# Altium schematic sheet ArtixBank14.SchDoc
size A
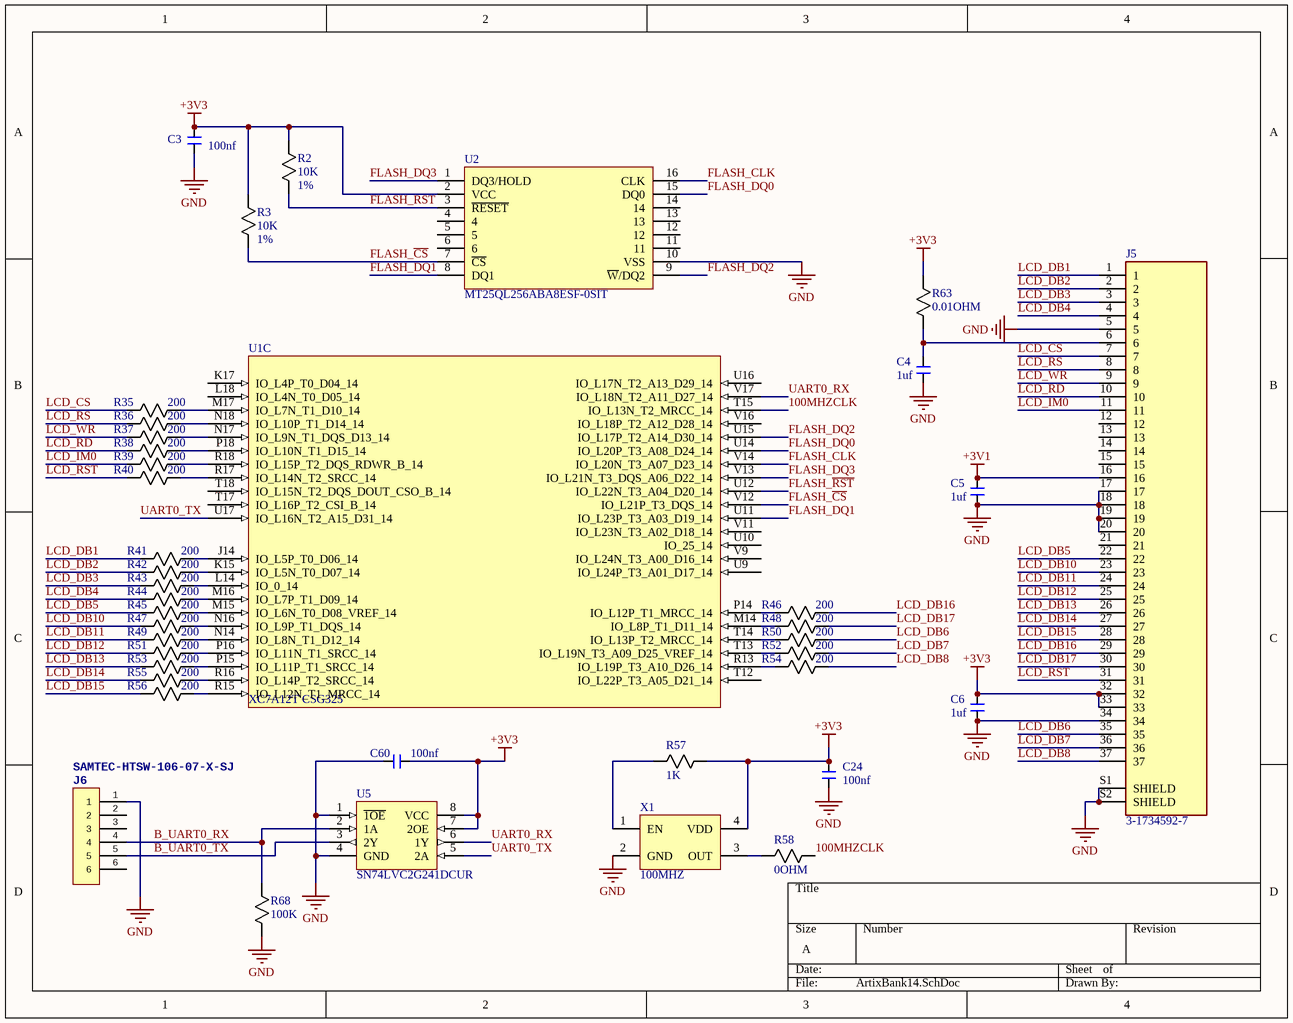
[diagram p0: ArtixBank14.SchDoc]

## Parts
C3  100nf  [0402Footprint]
C4  1uf  [0402Footprint]
C5  1uf  [0402Footprint]
C6  1uf  [0402Footprint]
C24  100nf  [0402Footprint]
C60  100nf  [0402Footprint]
J5  3-1734592-7  [TE_3-1734592-7]
J6  SAMTEC-HTSW-106-07-X-SJ  [SAMTEC-HTSW-106-07-X-S]
R2  10K  Tolerance: 1%  [RES_CRCW_0402]
R3  10K  Tolerance: 1%  [RES_CRCW_0402]
R35  200  [RES_CRCW_0402]
R36  200  [RES_CRCW_0402]
R37  200  [RES_CRCW_0402]
R38  200  [RES_CRCW_0402]
R39  200  [RES_CRCW_0402]
R40  200  [RES_CRCW_0402]
R41  200  [RES_CRCW_0402]
R42  200  [RES_CRCW_0402]
R43  200  [RES_CRCW_0402]
R44  200  [RES_CRCW_0402]
R45  200  [RES_CRCW_0402]
R46  200  [RES_CRCW_0402]
R47  200  [RES_CRCW_0402]
R48  200  [RES_CRCW_0402]
R49  200  [RES_CRCW_0402]
R50  200  [RES_CRCW_0402]
R51  200  [RES_CRCW_0402]
R52  200  [RES_CRCW_0402]
R53  200  [RES_CRCW_0402]
R54  200  [RES_CRCW_0402]
R55  200  [RES_CRCW_0402]
R56  200  [RES_CRCW_0402]
R57  1K  [RES_CRCW_0402]
R58  0OHM  [RES_CRCW_0402]
R63  0.01OHM  [RESC1508X06N]
R68  100K  [RES_CRCW_0402]
U1  XC7A12T CSG325  [BGA324C80P18X18_1500X1500X150]  (part C of 7)
U2  MT25QL256ABA8ESF-0SIT  [SOP127P1030X265-16N]
U5  SN74LVC2G241DCUR  [SOP50P310X90-8N]
X1  100MHZ  [SIT8008AI-12-33E-100.000000E]

## Nets
+3V1: C5.1 J5.16
+3V3: C3.1 C6.1 C24.1 C60.1 J5.32 J5.33 R2.1 R3.1 R57.1 R63.1 U2.2(VCC) U5.7(2OE) U5.8(VCC) X1.4(VDD)
GND: C3.2 C4.2 C5.2 C6.2 C24.2 C60.2 J5.5 J5.17 J5.18 J5.19 J5.20 J5.34 J5.S1(SHIELD) J5.S2(SHIELD) J6.1 R68.2 U2.10(VSS) U5.1(~{1OE}) U5.4(GND) X1.2(GND)
100MHZCLK: R58.1 U1.T15(IO_L13N_T2_MRCC_14)
B_UART0_RX: J6.4 R68.1 U5.2(1A)
B_UART0_TX: J6.5 U5.3(2Y)
FLASH_~{CS}: R3.2 U1.V12(IO_L21P_T3_DQS_14) U2.7(~{CS})
FLASH_CLK: U1.V14(IO_L20N_T3_A07_D23_14) U2.16(CLK)
FLASH_DQ0: U1.U14(IO_L20P_T3_A08_D24_14) U2.15(DQ0)
FLASH_DQ1: U1.U11(IO_L23P_T3_A03_D19_14) U2.8(DQ1)
FLASH_DQ2: U1.U15(IO_L17P_T2_A14_D30_14) U2.9(~{W}/DQ2)
FLASH_DQ3: U1.V13(IO_L21N_T3_DQS_A06_D22_14) U2.1(DQ3/HOLD)
FLASH_~{RST}: R2.2 U1.U12(IO_L22N_T3_A04_D20_14) U2.3(~{RESET})
LCD_CS: J5.7 R35.2
LCD_DB1: J5.1 R41.2
LCD_DB2: J5.2 R42.2
LCD_DB3: J5.3 R43.2
LCD_DB4: J5.4 R44.2
LCD_DB5: J5.22 R45.2
LCD_DB6: J5.35 R50.1
LCD_DB7: J5.36 R52.1
LCD_DB8: J5.37 R54.1
LCD_DB10: J5.23 R47.2
LCD_DB11: J5.24 R49.2
LCD_DB12: J5.25 R51.2
LCD_DB13: J5.26 R53.2
LCD_DB14: J5.27 R55.2
LCD_DB15: J5.28 R56.2
LCD_DB16: J5.29 R46.1
LCD_DB17: J5.30 R48.1
LCD_IM0: J5.11 R39.2
LCD_RD: J5.10 R38.2
LCD_RS: J5.8 R36.2
LCD_RST: J5.31 R40.2
LCD_WR: J5.9 R37.2
UART0_RX: U1.V17(IO_L18N_T2_A11_D27_14) U5.6(1Y)
UART0_TX: U1.U17(IO_L16N_T2_A15_D31_14) U5.5(2A)
NetC4_1: C4.1 J5.6 R63.2
NetR35_1: R35.1 U1.M17(IO_L7N_T1_D10_14)
NetR36_1: R36.1 U1.N18(IO_L10P_T1_D14_14)
NetR37_1: R37.1 U1.N17(IO_L9N_T1_DQS_D13_14)
NetR38_1: R38.1 U1.P18(IO_L10N_T1_D15_14)
NetR39_1: R39.1 U1.R18(IO_L15P_T2_DQS_RDWR_B_14)
NetR40_1: R40.1 U1.R17(IO_L14N_T2_SRCC_14)
NetR41_1: R41.1 U1.J14(IO_L5P_T0_D06_14)
NetR42_1: R42.1 U1.K15(IO_L5N_T0_D07_14)
NetR43_1: R43.1 U1.L14(IO_0_14)
NetR44_1: R44.1 U1.M16(IO_L7P_T1_D09_14)
NetR45_1: R45.1 U1.M15(IO_L6N_T0_D08_VREF_14)
NetR46_2: R46.2 U1.P14(IO_L12P_T1_MRCC_14)
NetR47_1: R47.1 U1.N16(IO_L9P_T1_DQS_14)
NetR48_2: R48.2 U1.M14(IO_L8P_T1_D11_14)
NetR49_1: R49.1 U1.N14(IO_L8N_T1_D12_14)
NetR50_2: R50.2 U1.T14(IO_L13P_T2_MRCC_14)
NetR51_1: R51.1 U1.P16(IO_L11N_T1_SRCC_14)
NetR52_2: R52.2 U1.T13(IO_L19N_T3_A09_D25_VREF_14)
NetR53_1: R53.1 U1.P15(IO_L11P_T1_SRCC_14)
NetR54_2: R54.2 U1.R13(IO_L19P_T3_A10_D26_14)
NetR55_1: R55.1 U1.R16(IO_L14P_T2_SRCC_14)
NetR56_1: R56.1 U1.R15(IO_L12N_T1_MRCC_14)
NetR57_2: R57.2 X1.1(EN)
NetR58_2: R58.2 X1.3(OUT)

Not connected (* = marked no-connect by the designer): J5 12 13 14 15 21; J6 2 3 6; U1 K17(IO_L4P_T0_D04_14) L18(IO_L4N_T0_D05_14) T12(IO_L22P_T3_A05_D21_14) T17(IO_L16P_T2_CSI_B_14) T18(IO_L15N_T2_DQS_DOUT_CSO_B_14) U9(IO_L24P_T3_A01_D17_14) U10(IO_25_14) U16(IO_L17N_T2_A13_D29_14) V9(IO_L24N_T3_A00_D16_14) V11(IO_L23N_T3_A02_D18_14) V16(IO_L18P_T2_A12_D28_14); U2 4 5 6 11 12 13 14

## Library data of the parts
C3 C24 C60 = 100nf_0402: 0402; Manufacturer 1: *; Manufacturer Part Number 1: *
C4-C6 = 1uf_0402: 0402; Manufacturer 1: *; Manufacturer Part Number 1: *
J5 = 3-1734592-7: Conn FPC Connector SKT 37 POS 0.5mm Solder RA SMD T/R; MF: TE Connectivity; SnapEDA_Link: https://www.snapeda.com/parts/3-1734592-7/TE%20Connectivity/view-part/4788466/?ref=snap; Package: None; DigiKey-Purchase-URL: https://snapeda.com/shop?store=DigiKey&id=4788466; Availability: Unavailable; Price: None; MP: 3-1734592-7; Value: *
J6 = SAMTEC-HTSW-106-07-X-SJ: 6 pin 2.54mm pitch header
R2 R3 = 10K_0402: 0402; Manufacturer Part Number 1: CRCW040210K0FKED; Manufacturer 1: *
R35-R56 = 200OHM_0402: 0402; Tolerance: 1%; Manufacturer 1: *; Manufacturer Part Number 1: *
R57 = 1k_0402: 0402; Tolerance: 1%; Manufacturer 1: *; Manufacturer Part Number 1: *
R58 = 0OHM_0402: 0402; Manufacturer 1: *; Manufacturer Part Number 1: *
R63 = 0.01OHM_0603: 0603; Manufacturer 1: *; Manufacturer Part Number 1: *
R68 = 100K_0402: 0402; Tolerance: 1%; Manufacturer 1: *; Manufacturer Part Number 1: *
U1 = XC7A12T_1CSG325I
U2 = MT25QL256ABA8ESF-0SIT: 256 Mb Flash Micron
U5 = SN74LVC2G241DCUR: Buffer, Non-Inverting 2 Element 1 Bit per Element 3-State Output 8-VSSOP; MF: Texas Instruments; Price: None; Value: *; MP: SN74LVC2G241DCUR; Package: VFSOP-8 Texas Instruments; SnapEDA_Link: https://www.snapeda.com/parts/SN74LVC2G241DCUR/Texas%20Instruments/view-part/278306/?ref=snap; Availability: Unavailable
X1 = SIT8008AI-12-33E-100.000000E